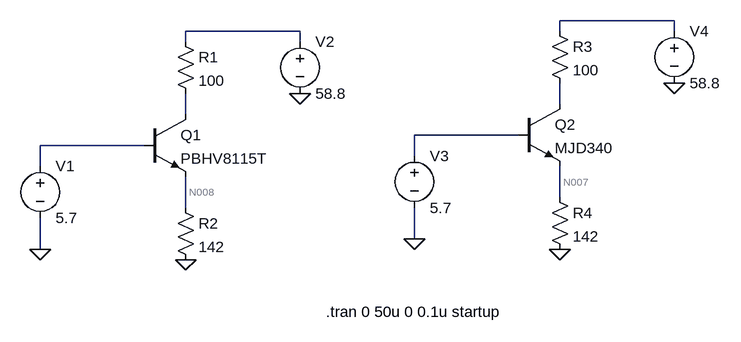
[diagram p0: schematic Power_Supply.asc]
Power_Supply.asc, the LTspice schematic file:
Version 4
SHEET 1 1008 680
WIRE 928 16 752 16
WIRE 352 32 176 32
WIRE 752 32 752 16
WIRE 928 32 928 16
WIRE 176 48 176 32
WIRE 352 48 352 32
WIRE 752 144 752 112
WIRE 176 160 176 128
WIRE 688 192 528 192
WIRE 112 208 -48 208
WIRE 528 224 528 192
WIRE -48 240 -48 208
WIRE 752 288 752 240
WIRE 176 304 176 256
WIRE 528 352 528 304
WIRE -48 368 -48 320
FLAG -48 368 0
FLAG 352 128 0
FLAG 176 384 0
FLAG 528 352 0
FLAG 928 112 0
FLAG 752 368 0
SYMBOL npn 112 160 R0
SYMATTR InstName Q1
SYMATTR Value PBHV8115T
SYMBOL voltage -48 224 R0
WINDOW 123 0 0 Left 0
WINDOW 39 0 0 Left 0
SYMATTR InstName V1
SYMATTR Value 5.7
SYMBOL voltage 352 32 R0
WINDOW 123 0 0 Left 0
WINDOW 39 0 0 Left 0
SYMATTR InstName V2
SYMATTR Value 58.8
SYMBOL res 160 32 R0
SYMATTR InstName R1
SYMATTR Value 100
SYMBOL res 160 288 R0
SYMATTR InstName R2
SYMATTR Value 142
SYMBOL npn 688 144 R0
SYMATTR InstName Q2
SYMATTR Value MJD340
SYMBOL voltage 528 208 R0
WINDOW 123 0 0 Left 0
WINDOW 39 0 0 Left 0
SYMATTR InstName V3
SYMATTR Value 5.7
SYMBOL voltage 928 16 R0
WINDOW 123 0 0 Left 0
WINDOW 39 0 0 Left 0
SYMATTR InstName V4
SYMATTR Value 58.8
SYMBOL res 736 16 R0
SYMATTR InstName R3
SYMATTR Value 100
SYMBOL res 736 272 R0
SYMATTR InstName R4
SYMATTR Value 142
TEXT 392 464 Left 2 !.tran 0 50u 0 0.1u startup

The netlist it stands for:
* Power_Supply.asc
Q1 N004 N006 N008 0 PBHV8115T
V1 N006 0 5.7
V2 N002 0 58.8
R1 N002 N004 100
R2 N008 0 142
Q2 N003 N005 N007 0 MJD340
V3 N005 0 5.7
V4 N001 0 58.8
R3 N001 N003 100
R4 N007 0 142
.model NPN NPN
.model PNP PNP
.lib standard.bjt
.tran 0 50u 0 0.1u startup
.backanno
.end

* Results of the author's LTspice run, read from the files saved beside the schematic
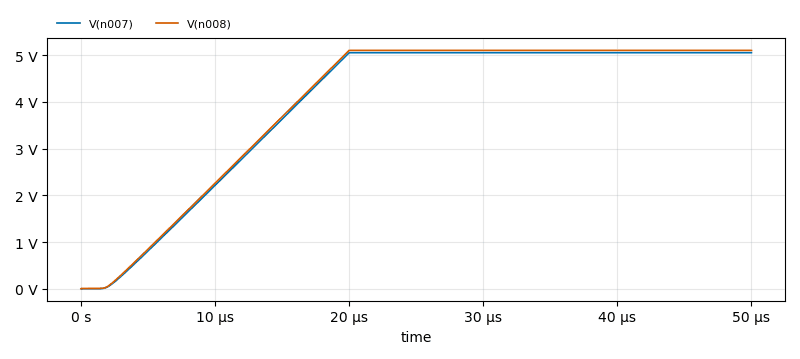
[diagram p1: Transient Analysis of Power_Supply.asc, plotted from the saved traces]
* Transient Analysis, 1 run:
*   V(n007): min 0 V, max 5.055 V, average 3.936 V, rms 4.287 V, last 5.055 V
*   V(n008): min 0 V, max 5.105 V, average 3.982 V, rms 4.333 V, last 5.105 V